# Altium schematic sheet 5_CURRENT_SOURCE.SchDoc
size 420 x 297 mm; SheetNumber: 5; SheetTotal: 7
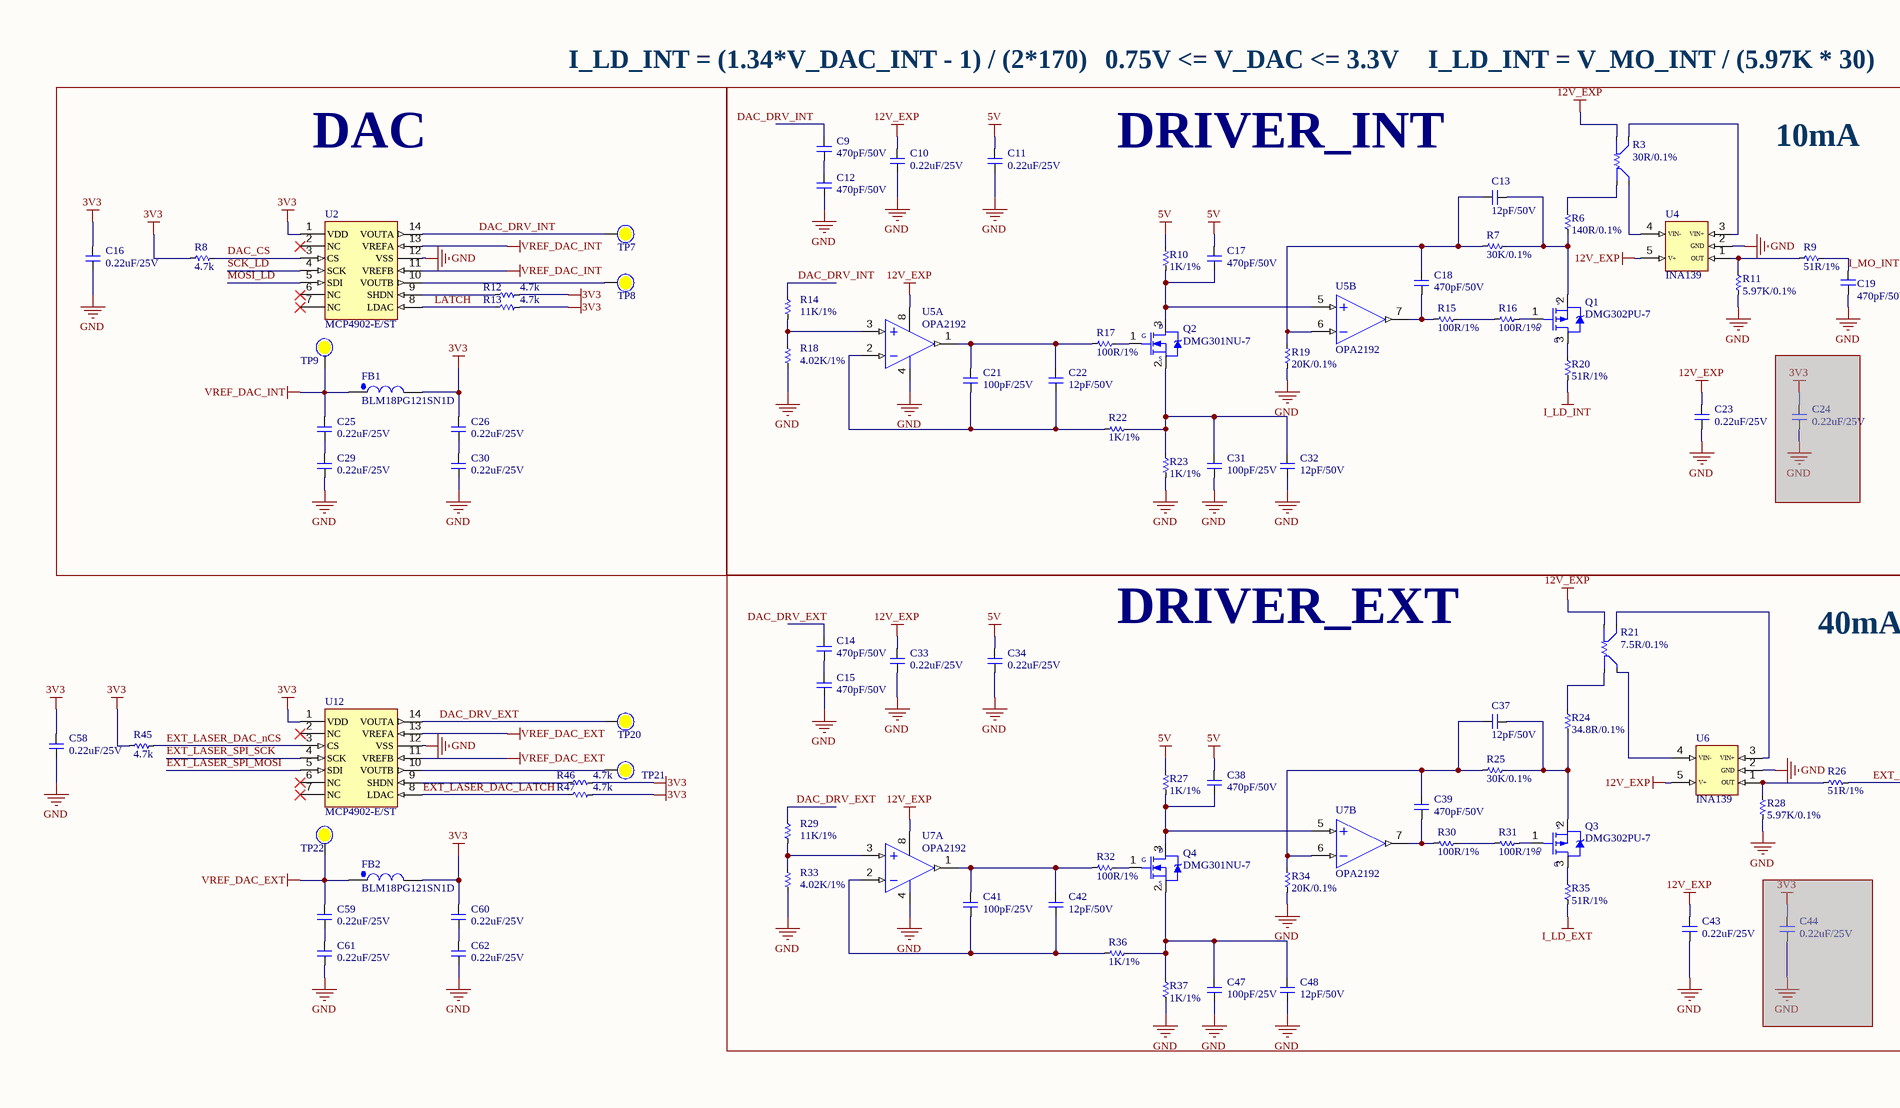
[diagram p0: 5_CURRENT_SOURCE.SchDoc, left]
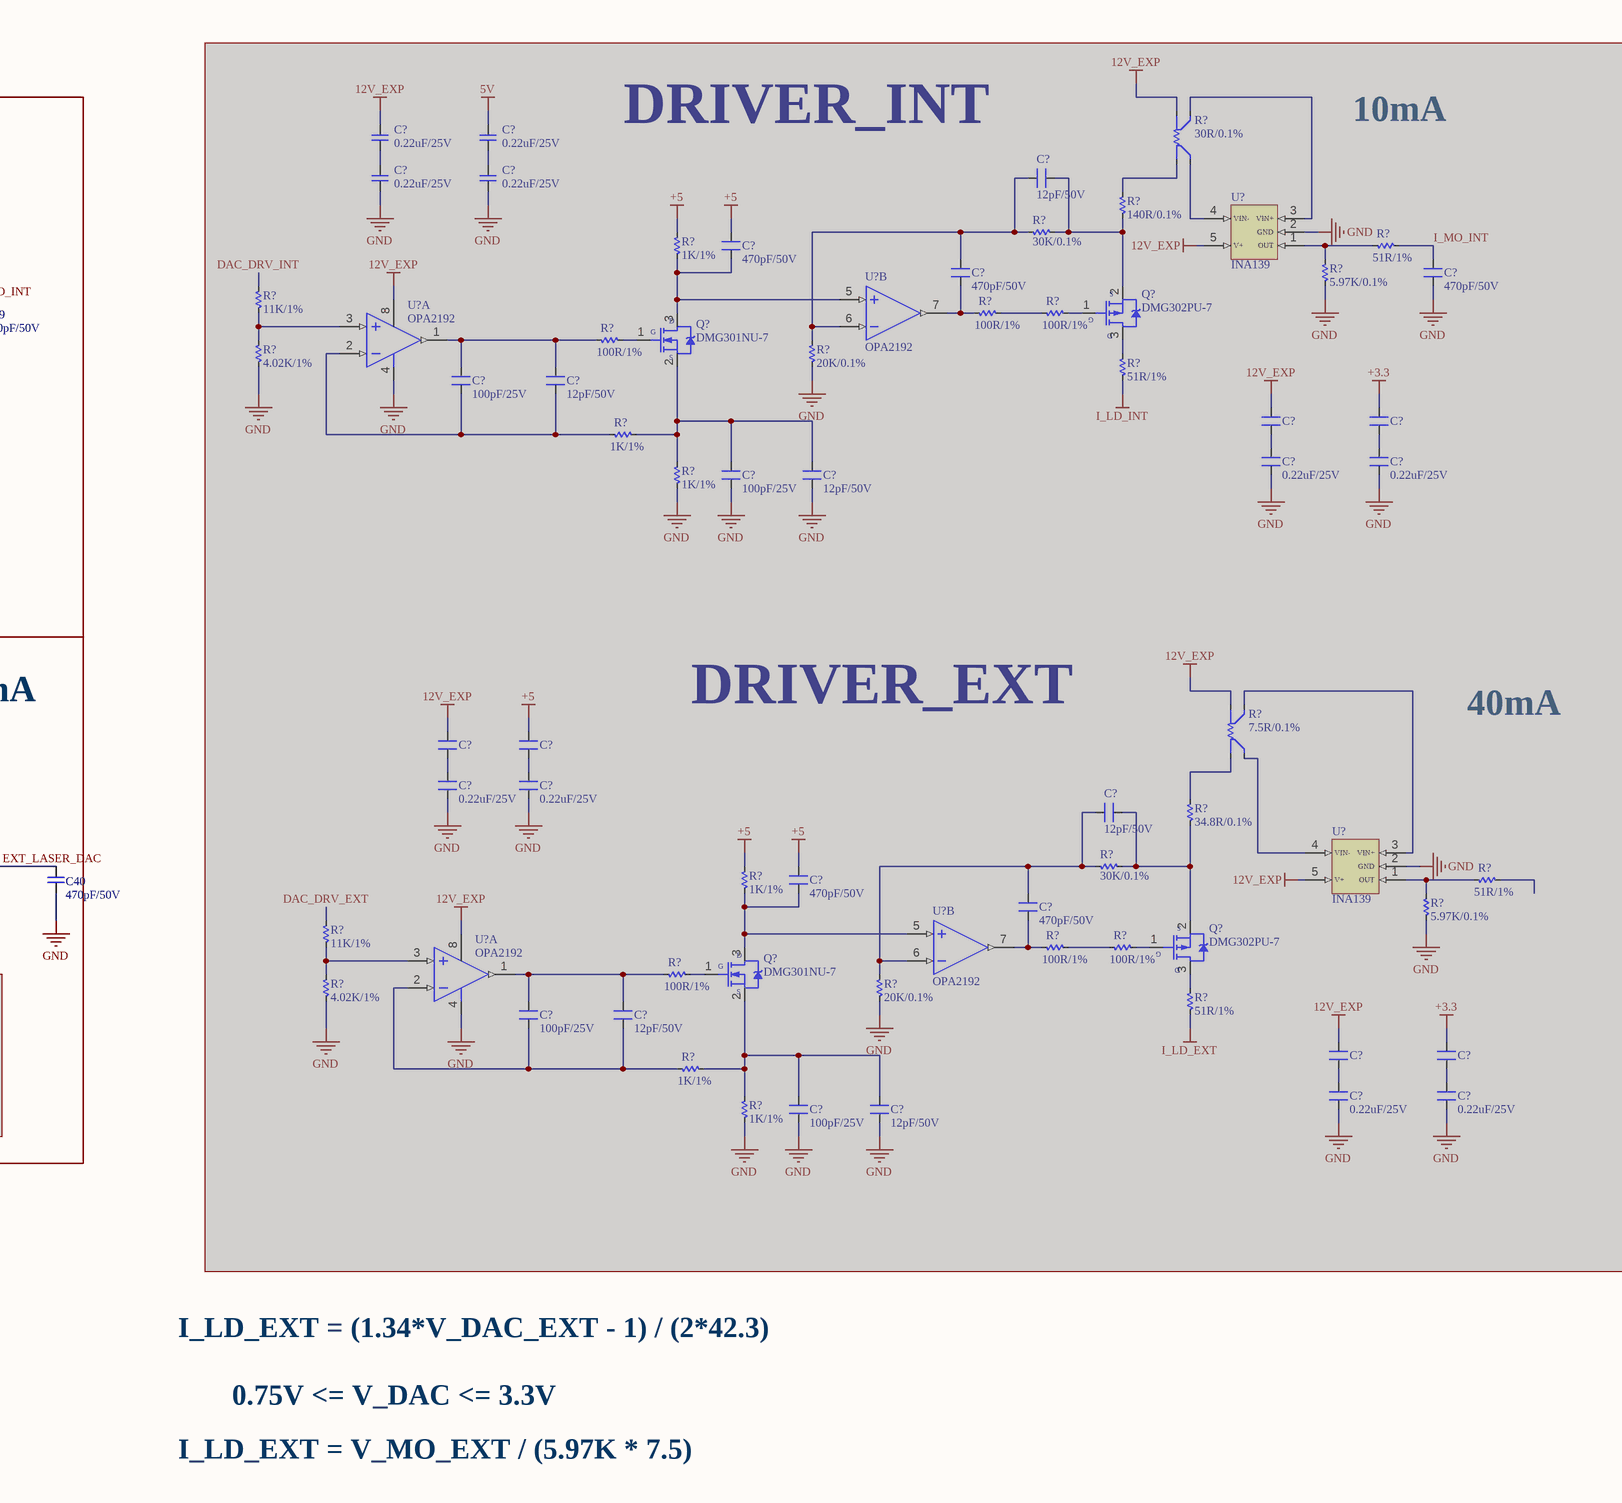
[diagram p1: 5_CURRENT_SOURCE.SchDoc, right]

## Parts
(Parts that share a designator on the sheet are numbered #1, #2 ... from top to bottom, then left to right.)
C9  470pF/50V  [CAP_C_1608X80]
C10  0.22uF/25V  [CAP_C_1608X80]
C11  0.22uF/25V  [CAP_C_1608X80]
C12  470pF/50V  [CAP_C_1608X80]
C13  12pF/50V  [CAP_C_1608X80]
C14  470pF/50V  [CAP_C_1608X80]
C15  470pF/50V  [CAP_C_1608X80]
C16  0.22uF/25V  [CAP_C_1608X80]
C17  470pF/50V  [CAP_C_1608X80]
C18  470pF/50V  [CAP_C_1608X80]
C19  470pF/50V  [CAP_C_1608X80]
C21  100pF/25V  [CAP_C_1608X80]
C22  12pF/50V  [CAP_C_1608X80]
C23  0.22uF/25V  [CAP_C_1608X80]
C24  0.22uF/25V  [CAP_C_1608X80]  (masked out: inside a compile mask, not in the netlist)
C25  0.22uF/25V  [CAP_C_1608X80]
C26  0.22uF/25V  [CAP_C_1608X80]
C29  0.22uF/25V  [CAP_C_1608X80]
C30  0.22uF/25V  [CAP_C_1608X80]
C31  100pF/25V  [CAP_C_1608X80]
C32  12pF/50V  [CAP_C_1608X80]
C33  0.22uF/25V  [CAP_C_1608X80]
C34  0.22uF/25V  [CAP_C_1608X80]
C37  12pF/50V  [CAP_C_1608X80]
C38  470pF/50V  [CAP_C_1608X80]
C39  470pF/50V  [CAP_C_1608X80]
C40  470pF/50V  [CAP_C_1608X80]
C41  100pF/25V  [CAP_C_1608X80]
C42  12pF/50V  [CAP_C_1608X80]
C43  0.22uF/25V  [CAP_C_1608X80]
C44  0.22uF/25V  [CAP_C_1608X80]  (masked out: inside a compile mask, not in the netlist)
C47  100pF/25V  [CAP_C_1608X80]
C48  12pF/50V  [CAP_C_1608X80]
C58  0.22uF/25V  [CAP_C_1608X80]
C59  0.22uF/25V  [CAP_C_1608X80]
C60  0.22uF/25V  [CAP_C_1608X80]
C61  0.22uF/25V  [CAP_C_1608X80]
C62  0.22uF/25V  [CAP_C_1608X80]
C?#1  0.22uF/25V  [CAP_C_1005X50_L]  (masked out: inside a compile mask, not in the netlist)
C?#2  0.22uF/25V  [CAP_C_1005X50_L]  (masked out: inside a compile mask, not in the netlist)
C?#3  0.22uF/25V  [CAP_C_1005X50_L]  (masked out: inside a compile mask, not in the netlist)
C?#4  0.22uF/25V  [CAP_C_1005X50_L]  (masked out: inside a compile mask, not in the netlist)
C?#5  12pF/50V  [SM-0603]  (masked out: inside a compile mask, not in the netlist)
C?#6  470pF/50V  [SM-0603]  (masked out: inside a compile mask, not in the netlist)
C?#7  470pF/50V  [SM-0603]  (masked out: inside a compile mask, not in the netlist)
C?#8  470pF/50V  [SM-0603]  (masked out: inside a compile mask, not in the netlist)
C?#9  100pF/25V  [SM-0603]  (masked out: inside a compile mask, not in the netlist)
C?#10  12pF/50V  [SM-0603]  (masked out: inside a compile mask, not in the netlist)
C?#11  0.22uF/25V  [SM-0603]  (value not drawn)  (masked out: inside a compile mask, not in the netlist)
C?#12  0.22uF/25V  [SM-0603]  (value not drawn)  (masked out: inside a compile mask, not in the netlist)
C?#13  0.22uF/25V  [SM-0603]  (masked out: inside a compile mask, not in the netlist)
C?#14  0.22uF/25V  [SM-0603]  (masked out: inside a compile mask, not in the netlist)
C?#15  100pF/25V  [SM-0603]  (masked out: inside a compile mask, not in the netlist)
C?#16  12pF/50V  [SM-0603]  (masked out: inside a compile mask, not in the netlist)
C?#17  0.22uF/25V  [SM-0603]  (value not drawn)  (masked out: inside a compile mask, not in the netlist)
C?#18  0.22uF/25V  [SM-0603]  (value not drawn)  (masked out: inside a compile mask, not in the netlist)
C?#19  0.22uF/25V  [SM-0603]  (masked out: inside a compile mask, not in the netlist)
C?#20  0.22uF/25V  [SM-0603]  (masked out: inside a compile mask, not in the netlist)
C?#21  12pF/50V  [SM-0603]  (masked out: inside a compile mask, not in the netlist)
C?#22  470pF/50V  [SM-0603]  (masked out: inside a compile mask, not in the netlist)
C?#23  470pF/50V  [SM-0603]  (masked out: inside a compile mask, not in the netlist)
C?#24  100pF/25V  [SM-0603]  (masked out: inside a compile mask, not in the netlist)
C?#25  12pF/50V  [SM-0603]  (masked out: inside a compile mask, not in the netlist)
C?#26  0.22uF/25V  [SM-0603]  (value not drawn)  (masked out: inside a compile mask, not in the netlist)
C?#27  0.22uF/25V  [SM-0603]  (value not drawn)  (masked out: inside a compile mask, not in the netlist)
C?#28  0.22uF/25V  [SM-0603]  (masked out: inside a compile mask, not in the netlist)
C?#29  0.22uF/25V  [SM-0603]  (masked out: inside a compile mask, not in the netlist)
C?#30  100pF/25V  [SM-0603]  (masked out: inside a compile mask, not in the netlist)
C?#31  12pF/50V  [SM-0603]  (masked out: inside a compile mask, not in the netlist)
FB1  BLM18PG121SN1D  [IND_C_1608X60]
FB2  BLM18PG121SN1D  [IND_C_1608X60]
Q1  DMG302PU-7  [SOT23-3-132]
Q2  DMG301NU-7  [SOT23-3-132]
Q3  DMG302PU-7  [SOT23-3-132]
Q4  DMG301NU-7  [SOT23-3-132]
Q?#1  DMG302PU-7  [SOT23-3-132]  (masked out: inside a compile mask, not in the netlist)
Q?#2  DMG301NU-7  [SOT23-3-132]  (masked out: inside a compile mask, not in the netlist)
Q?#3  DMG302PU-7  [SOT23-3-132]  (masked out: inside a compile mask, not in the netlist)
Q?#4  DMG301NU-7  [SOT23-3-132]  (masked out: inside a compile mask, not in the netlist)
R3  30R/0.1%  [RES_SMD_0603_SHUNT]
R6  140R/0.1%  [RES_C_1608X60]
R7  30K/0.1%  [RES_C_1608X60]
R8  4.7k  [RES_C_1608X60]
R9  51R/1%  [RES_C_1608X60]
R10  1K/1%  [RES_C_1608X60]
R11  5.97K/0.1%  [RES_C_1608X60]
R12  4.7k  [RES_C_1608X60]
R13  4.7k  [RES_C_1608X60]
R14  11K/1%  [RES_C_1608X60]
R15  100R/1%  [RES_C_1608X60]
R16  100R/1%  [RES_C_1608X60]
R17  100R/1%  [RES_C_1608X60]
R18  4.02K/1%  [RES_C_1608X60]
R19  20K/0.1%  [RES_C_1608X60]
R20  51R/1%  [RES_C_1608X60]
R21  7.5R/0.1%  [RES_SMD_0603_SHUNT]
R22  1K/1%  [RES_C_1608X60]
R23  1K/1%  [RES_C_1608X60]
R24  34.8R/0.1%  [RES_C_1608X60]
R25  30K/0.1%  [RES_C_1608X60]
R26  51R/1%  [RES_C_1608X60]
R27  1K/1%  [RES_C_1608X60]
R28  5.97K/0.1%  [RES_C_1608X60]
R29  11K/1%  [RES_C_1608X60]
R30  100R/1%  [RES_C_1608X60]
R31  100R/1%  [RES_C_1608X60]
R32  100R/1%  [RES_C_1608X60]
R33  4.02K/1%  [RES_C_1608X60]
R34  20K/0.1%  [RES_C_1608X60]
R35  51R/1%  [RES_C_1608X60]
R36  1K/1%  [RES_C_1608X60]
R37  1K/1%  [RES_C_1608X60]
R45  4.7k  [RES_C_1608X60]
R46  4.7k  [RES_C_1608X60]
R47  4.7k  [RES_C_1608X60]
R?#1  30R/0.1%  [RES_SMD_0603_SHUNT]  (masked out: inside a compile mask, not in the netlist)
R?#2  140R/0.1%  [RES-SMD-0603]  (masked out: inside a compile mask, not in the netlist)
R?#3  30K/0.1%  [RES-SMD-0603]  (masked out: inside a compile mask, not in the netlist)
R?#4  1K/1%  [RES-SMD-0603]  (masked out: inside a compile mask, not in the netlist)
R?#5  51R/1%  [RES-SMD-0603]  (masked out: inside a compile mask, not in the netlist)
R?#6  5.97K/0.1%  [RES-SMD-0603]  (masked out: inside a compile mask, not in the netlist)
R?#7  11K/1%  [RES-SMD-0603]  (masked out: inside a compile mask, not in the netlist)
R?#8  100R/1%  [RES-SMD-0603]  (masked out: inside a compile mask, not in the netlist)
R?#9  100R/1%  [RES-SMD-0603]  (masked out: inside a compile mask, not in the netlist)
R?#10  100R/1%  [RES-SMD-0603]  (masked out: inside a compile mask, not in the netlist)
R?#11  4.02K/1%  [RES-SMD-0603]  (masked out: inside a compile mask, not in the netlist)
R?#12  20K/0.1%  [RES-SMD-0603]  (masked out: inside a compile mask, not in the netlist)
R?#13  51R/1%  [RES-SMD-0603]  (masked out: inside a compile mask, not in the netlist)
R?#14  1K/1%  [RES-SMD-0603]  (masked out: inside a compile mask, not in the netlist)
R?#15  1K/1%  [RES-SMD-0603]  (masked out: inside a compile mask, not in the netlist)
R?#16  7.5R/0.1%  [RES_SMD_0603_SHUNT]  (masked out: inside a compile mask, not in the netlist)
R?#17  34.8R/0.1%  [RES-SMD-0603]  (masked out: inside a compile mask, not in the netlist)
R?#18  30K/0.1%  [RES-SMD-0603]  (masked out: inside a compile mask, not in the netlist)
R?#19  1K/1%  [RES-SMD-0603]  (masked out: inside a compile mask, not in the netlist)
R?#20  51R/1%  [RES-SMD-0603]  (masked out: inside a compile mask, not in the netlist)
R?#21  5.97K/0.1%  [RES-SMD-0603]  (masked out: inside a compile mask, not in the netlist)
R?#22  11K/1%  [RES-SMD-0603]  (masked out: inside a compile mask, not in the netlist)
R?#23  100R/1%  [RES-SMD-0603]  (masked out: inside a compile mask, not in the netlist)
R?#24  100R/1%  [RES-SMD-0603]  (masked out: inside a compile mask, not in the netlist)
R?#25  100R/1%  [RES-SMD-0603]  (masked out: inside a compile mask, not in the netlist)
R?#26  4.02K/1%  [RES-SMD-0603]  (masked out: inside a compile mask, not in the netlist)
R?#27  20K/0.1%  [RES-SMD-0603]  (masked out: inside a compile mask, not in the netlist)
R?#28  51R/1%  [RES-SMD-0603]  (masked out: inside a compile mask, not in the netlist)
R?#29  1K/1%  [RES-SMD-0603]  (masked out: inside a compile mask, not in the netlist)
R?#30  1K/1%  [RES-SMD-0603]  (masked out: inside a compile mask, not in the netlist)
TP7  (no value)  [Testpoint_50]  (no BOM)
TP8  (no value)  [Testpoint_50]  (no BOM)
TP9  (no value)  [Testpoint_50]  (no BOM)
TP20  (no value)  [Testpoint_50]  (no BOM)
TP21  (no value)  [Testpoint_50]  (no BOM)
TP22  (no value)  [Testpoint_50]  (no BOM)
U2  MCP4902-E/ST  [TSSOP14]
U4  INA139  [SOT23-5]
U5  OPA2192  [SO8]  (parts A,B of 2)
U6  INA139  [SOT23-5]
U7  OPA2192  [SO8]  (parts A,B of 2)
U12  MCP4902-E/ST  [TSSOP14]
U?#1  INA139  [SOT23-5]  (masked out: inside a compile mask, not in the netlist)
U?#2  OPA2192  [SO8]  (part B of 2)  (masked out: inside a compile mask, not in the netlist)
U?#3  OPA2192  [SO8]  (part A of 2)  (masked out: inside a compile mask, not in the netlist)
U?#4  INA139  [SOT23-5]  (masked out: inside a compile mask, not in the netlist)
U?#5  OPA2192  [SO8]  (part B of 2)  (masked out: inside a compile mask, not in the netlist)
U?#6  OPA2192  [SO8]  (part A of 2)  (masked out: inside a compile mask, not in the netlist)

## Blocks framed on the sheet
DAC: C16 C25 C26 C29 C30 FB1 R8 R12 R13 TP7-TP9 U2
DRIVER_INT: C9-C13 C17-C19 C21-C24 C31 C32 Q1 Q2 R3 R6 R7 R9-R11 R14-R20 R22 R23 U4 U5
DRIVER_EXT: C14 C15 C33 C34 C37-C44 C47 C48 Q3 Q4 R21 R24-R37 U6 U7

## Nets
3V3: C16.2 C26.2 C58.2 C60.2 FB1.2 FB2.2 R8.1 R12.2 R13.2 R45.1 R46.2 R47.2 U2.1(VDD) U12.1(VDD)
5V: C11.2 C17.2 C34.2 C38.2 R10.2 R27.2
12V_EXP: C10.2 C23.2 C33.2 C43.2 R3.1 R21.1 U4.5(V+) U5.8(+V) U6.5(V+) U7.8(+V)
GND: C10.1 C11.1 C12.1 C15.1 C16.1 C19.2 C23.1 C29.1 C30.1 C31.1 C32.1 C33.1 C34.1 C40.2 C43.1 C47.1 C48.1 C58.1 C61.1 C62.1 R11.2 R18.1 R19.1 R23.1 R28.2 R33.1 R34.1 R37.1 U2.12(VSS) U4.2(GND) U5.4(-V) U6.2(GND) U7.4(-V) U12.12(VSS)
I_LD_EXT: R35.1
I_LD_INT: R20.1
VREF_DAC_EXT: C59.2 FB2.1 TP22.1 U12.11(VREFB) U12.13(VREFA)
VREF_DAC_INT: C25.2 FB1.1 TP9.1 U2.11(VREFB) U2.13(VREFA)
DAC_CS: R8.2 U2.3(CS)
DAC_DRV_EXT: C14.2 R29.2 TP20.1 U12.14(VOUTA)
DAC_DRV_INT: C9.2 R14.2 TP7.1 U2.14(VOUTA)
EXT_LASER_DAC: C40.1 R26.2
EXT_LASER_DAC_LATCH: R47.1 U12.8(LDAC)
EXT_LASER_DAC_nCS: R45.2 U12.3(CS)
EXT_LASER_SPI_MOSI: U12.5(SDI)
EXT_LASER_SPI_SCK: U12.4(SCK)
I_MO_INT: C19.1 R9.2
LATCH: R13.1 U2.8(LDAC)
MOSI_LD: U2.5(SDI)
SCK_LD: U2.4(SCK)
NetC9_1: C9.1 C12.2
NetC13_1: C13.1 C18.2 R7.2 R19.2 U5.6(IN-)
NetC13_2: C13.2 Q1.2(S) R6.1 R7.1
NetC14_1: C14.1 C15.2
NetC17_1: C17.1 Q2.3(D) R10.1 U5.5(IN+)
NetC18_1: C18.1 R15.2 U5.7(OUT)
NetC21_1: C21.1 C22.1 R22.2 U5.2(IN-)
NetC21_2: C21.2 C22.2 R17.2 U5.1(OUT)
NetC25_1: C25.1 C29.2
NetC26_1: C26.1 C30.2
NetC31_2: C31.2 C32.2 Q2.2(S) R22.1 R23.2
NetC37_1: C37.1 C39.2 R25.2 R34.2 U7.6(IN-)
NetC37_2: C37.2 Q3.2(S) R24.1 R25.1
NetC38_1: C38.1 Q4.3(D) R27.1 U7.5(IN+)
NetC39_1: C39.1 R30.2 U7.7(OUT)
NetC41_1: C41.1 C42.1 R36.2 U7.2(IN-)
NetC41_2: C41.2 C42.2 R32.2 U7.1(OUT)
NetC47_2: C47.2 C48.2 Q4.2(S) R36.1 R37.2
NetC59_1: C59.1 C61.2
NetC60_1: C60.1 C62.2
NetQ1_1: Q1.1(G) R16.1
NetQ1_3: Q1.3(D) R20.2
NetQ2_1: Q2.1(G) R17.1
NetQ3_1: Q3.1(G) R31.1
NetQ3_3: Q3.3(D) R35.2
NetQ4_1: Q4.1(G) R32.1
NetR3_2: R3.2 R6.2
NetR3_3: R3.3 U4.3(VIN+)
NetR3_4: R3.4 U4.4(VIN-)
NetR9_1: R9.1 R11.1 U4.1(OUT)
NetR12_1: R12.1 U2.9(SHDN)
NetR14_1: R14.1 R18.2 U5.3(IN+)
NetR15_1: R15.1 R16.2
NetR21_2: R21.2 R24.2
NetR21_3: R21.3 U6.3(VIN+)
NetR21_4: R21.4 U6.4(VIN-)
NetR26_1: R26.1 R28.1 U6.1(OUT)
NetR29_1: R29.1 R33.2 U7.3(IN+)
NetR30_1: R30.1 R31.2
NetR46_1: R46.1 U12.9(SHDN)
NetTP8_1: TP8.1 U2.10(VOUTB)
NetTP21_1: TP21.1 U12.10(VOUTB)

Not connected (* = marked no-connect by the designer): U2 2(NC)* 6(NC)* 7(NC)*; U12 2(NC)* 6(NC)* 7(NC)*

## Notes on the sheet
- I_LD_INT = (1.34*V_DAC_INT - 1) / (2*170)
- 0.75V <= V_DAC <= 3.3V
- I_LD_INT = V_MO_INT / (5.97K * 30)
- 10mA
- DRIVER_INT
- 40mA
- DRIVER_EXT
- I_LD_EXT = (1.34*V_DAC_EXT - 1) / (2*42.3)
- I_LD_EXT = V_MO_EXT / (5.97K * 7.5)
- Project:
- Sub-system:
- Design by:
- Sheet title:
- Sheet
- A3
- of
- Checked by:
- Approved by:
- Revision:
- Document No:
- Size:
- Date:

## Library data of the parts
C9-C19 C21-C26 C29-C34 C37-C44 C47 C48 C58-C62 C?#1-C?#4 = _CAP_C_2: CAP
C?#5 C?#10 C?#16 C?#21 C?#25 C?#31 = CM: CL10C120JB81PNC; Value: 103
C?#6-C?#8 C?#22 C?#23 = CM: CL10B471KB8NNNC; Value: 103
C?#9 C?#15 C?#24 C?#30 = CM: C0603C101M3HACTU; Value: 103
C?#11-C?#14 C?#17-C?#20 C?#26-C?#29 = CM: CL10B224KA8NNNC; Value: 103
FB1 FB2 = _IND
Q1 Q3 Q?#1 Q?#3 = P_MOSFET
Q2 Q4 Q?#2 Q?#4 = N_MOSFET
R3 R?#1 = RES_SMD_SHUNT: RN73R1JTTD30R0B25
R6-R20 R22-R37 R45-R47 = _RES_B_2: RES
R21 R?#16 = RES_SMD_SHUNT: RT0603BRD077R5L
R?#2 = Res-SMD: ERA-3AEB1400V; Manufacturer: Generic Components; Class: Passive; Published: 08/06/2000; Publisher: Altium Hobart Technology Centre
R?#3 R?#18 = Res-SMD: ERA-3AEB303V; Manufacturer: Generic Components; Class: Passive; Published: 08/06/2000; Publisher: Altium Hobart Technology Centre
R?#4 R?#14 R?#15 R?#19 R?#29 R?#30 = Res-SMD: ERJ-3EKF1001V; Manufacturer: Generic Components; Class: Passive; Published: 08/06/2000; Publisher: Altium Hobart Technology Centre
R?#5 R?#13 R?#20 R?#28 = Res-SMD: ERJ-3EKF51R0V; Manufacturer: Generic Components; Class: Passive; Published: 08/06/2000; Publisher: Altium Hobart Technology Centre
R?#6 R?#21 = Res-SMD: RN73R1JTTD5971B25; Manufacturer: Generic Components; Class: Passive; Published: 08/06/2000; Publisher: Altium Hobart Technology Centre
R?#7 R?#22 = Res-SMD: ERJ-3EKF1102V; Manufacturer: Generic Components; Class: Passive; Published: 08/06/2000; Publisher: Altium Hobart Technology Centre
R?#8-R?#10 R?#23-R?#25 = Res-SMD: ERJ-PA3D1000V; Manufacturer: Generic Components; Class: Passive; Published: 08/06/2000; Publisher: Altium Hobart Technology Centre
R?#11 R?#26 = Res-SMD: RC0603FR-074K02L; Manufacturer: Generic Components; Class: Passive; Published: 08/06/2000; Publisher: Altium Hobart Technology Centre
R?#12 R?#27 = Res-SMD: ERA-3AEB203V; Manufacturer: Generic Components; Class: Passive; Published: 08/06/2000; Publisher: Altium Hobart Technology Centre
R?#17 = Res-SMD: RN73R1JTTD34R8B25; Manufacturer: Generic Components; Class: Passive; Published: 08/06/2000; Publisher: Altium Hobart Technology Centre
TP7-TP9 TP20-TP22 = Test Point: Solder: NF
U2 U12 = MCP4902
U4 U6 U?#1 U?#4 = INA139: INA139NA/250
U5 U7 U?#2 U?#3 U?#5 U?#6 = LM358: OPA2192IDR; Value: LM358